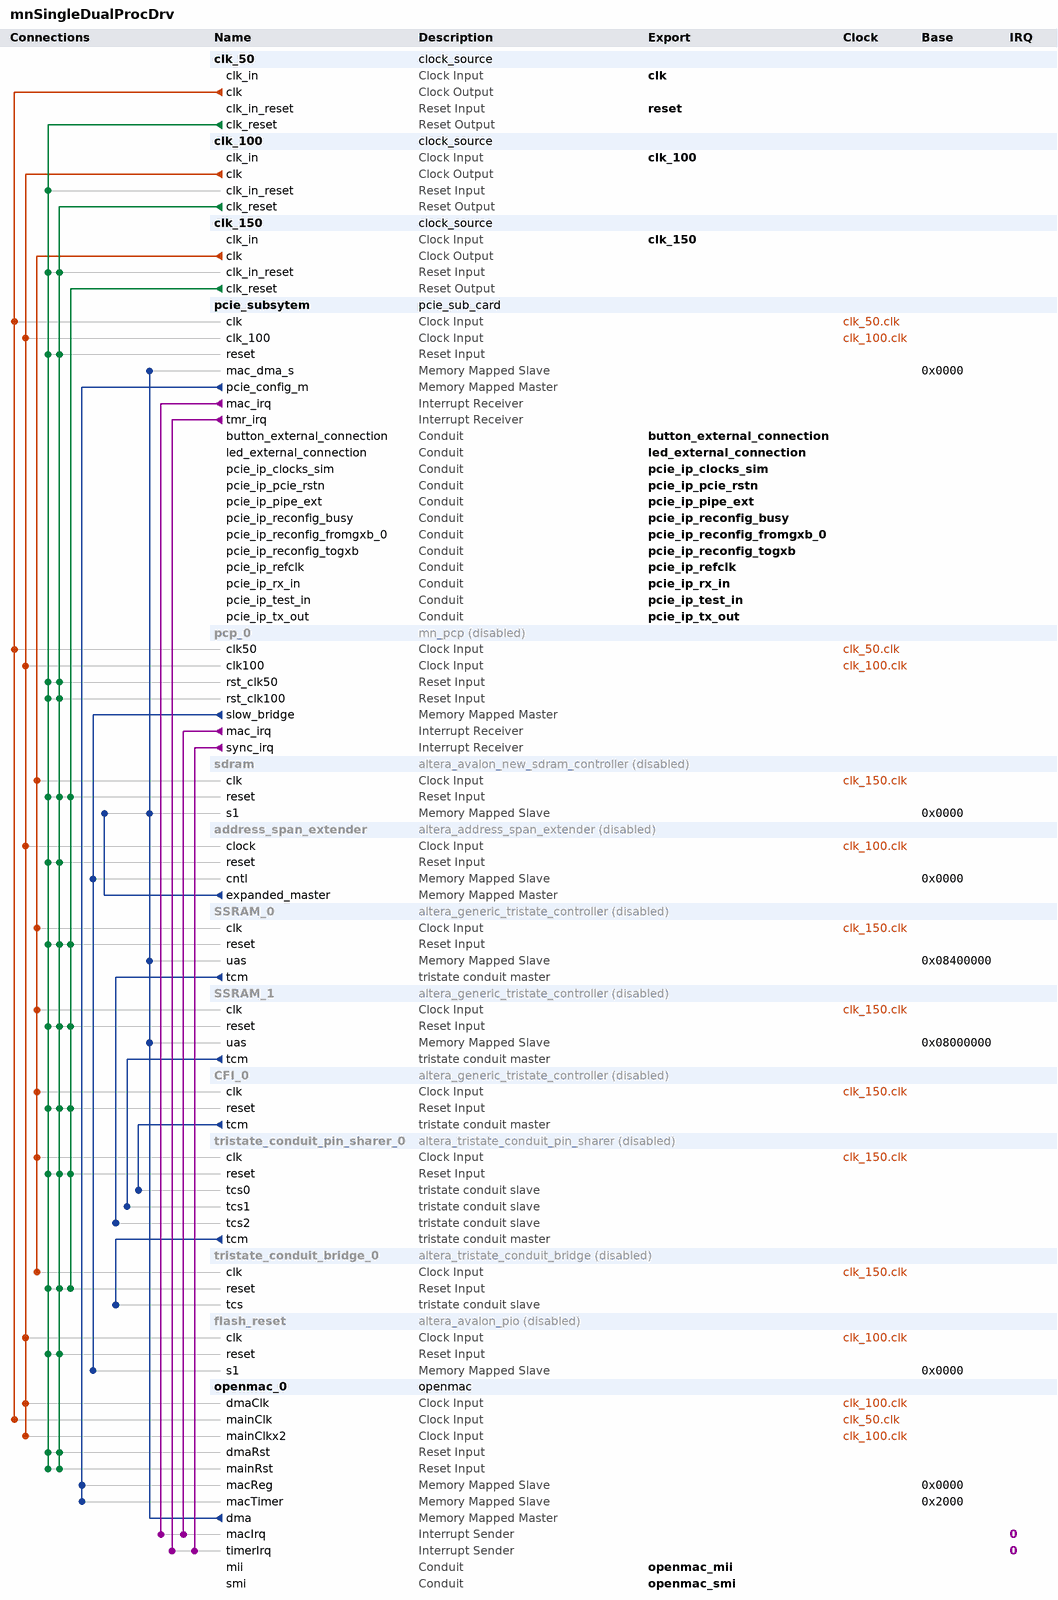
[diagram p0: system contents]
# Platform Designer (Qsys) system mnSingleDualProcDrv, Cyclone IV GX EP4CGX150DF31C7
# Parameters at their usual value, and those the tool derives, are not listed.
package require -exact qsys 14.0
create_system mnSingleDualProcDrv
set_project_property DEVICE_FAMILY {Cyclone IV GX}
set_project_property DEVICE EP4CGX150DF31C7

add_instance clk_50 clock_source 14.0
set_instance_parameter_value clk_50 clockFrequency 50000000

add_instance clk_100 clock_source 14.0
set_instance_parameter_value clk_100 clockFrequency 100000000

add_instance clk_150 clock_source 14.0
set_instance_parameter_value clk_150 clockFrequency 150000000

add_instance pcie_subsytem pcie_sub_card 1.0

add_instance pcp_0 mn_pcp 1.0
set_instance_property pcp_0 ENABLED false

add_instance sdram altera_avalon_new_sdram_controller 14.0
set_instance_property sdram ENABLED false
set_instance_parameter_value sdram TAC 5.5
set_instance_parameter_value sdram TRCD 20.0
set_instance_parameter_value sdram TRP 20.0
set_instance_parameter_value sdram casLatency 3
set_instance_parameter_value sdram columnWidth 10
set_instance_parameter_value sdram dataWidth 32
set_instance_parameter_value sdram generateSimulationModel true
set_instance_parameter_value sdram model single_Micron_MT48LC4M32B2_7_chip
set_instance_parameter_value sdram numberOfBanks 4
set_instance_parameter_value sdram numberOfChipSelects 1
set_instance_parameter_value sdram powerUpDelay 100.0
set_instance_parameter_value sdram refreshPeriod 15.625
set_instance_parameter_value sdram rowWidth 13

add_instance address_span_extender altera_address_span_extender 14.0
set_instance_property address_span_extender ENABLED false
set_instance_parameter_value address_span_extender DATA_WIDTH 32
set_instance_parameter_value address_span_extender MASTER_ADDRESS_WIDTH 27
set_instance_parameter_value address_span_extender SLAVE_ADDRESS_WIDTH 16
set_instance_parameter_value address_span_extender BURSTCOUNT_WIDTH 1
set_instance_parameter_value address_span_extender MASTER_ADDRESS_DEF 0
set_instance_parameter_value address_span_extender TERMINATE_SLAVE_PORT false
set_instance_parameter_value address_span_extender MAX_PENDING_READS 1

add_instance SSRAM_0 altera_generic_tristate_controller 14.0
set_instance_property SSRAM_0 ENABLED false
set_instance_parameter_value SSRAM_0 TCM_ADDRESS_W 22
set_instance_parameter_value SSRAM_0 TCM_DATA_W 32
set_instance_parameter_value SSRAM_0 TCM_BYTEENABLE_W 4
set_instance_parameter_value SSRAM_0 TCM_READ_WAIT 3
set_instance_parameter_value SSRAM_0 TCM_WRITE_WAIT 3
set_instance_parameter_value SSRAM_0 TCM_SETUP_WAIT 3
set_instance_parameter_value SSRAM_0 TCM_DATA_HOLD 3
set_instance_parameter_value SSRAM_0 TCM_MAX_PENDING_READ_TRANSACTIONS 5
set_instance_parameter_value SSRAM_0 TCM_TURNAROUND_TIME 2
set_instance_parameter_value SSRAM_0 TCM_TIMING_UNITS 1
set_instance_parameter_value SSRAM_0 TCM_READLATENCY 3
set_instance_parameter_value SSRAM_0 TCM_SYMBOLS_PER_WORD 4
set_instance_parameter_value SSRAM_0 USE_READ 0
set_instance_parameter_value SSRAM_0 USE_BEGINTRANSFER 1
set_instance_parameter_value SSRAM_0 USE_BYTEENABLE 1
set_instance_parameter_value SSRAM_0 USE_OUTPUTENABLE 1
set_instance_parameter_value SSRAM_0 ACTIVE_LOW_READ 0
set_instance_parameter_value SSRAM_0 ACTIVE_LOW_BYTEENABLE 1
set_instance_parameter_value SSRAM_0 ACTIVE_LOW_OUTPUTENABLE 1
set_instance_parameter_value SSRAM_0 ACTIVE_LOW_BEGINTRANSFER 1
set_instance_parameter_value SSRAM_0 CHIPSELECT_THROUGH_READLATENCY 0
set_instance_parameter_value SSRAM_0 MODULE_ASSIGNMENT_KEYS embeddedsw.configuration.hwClassnameDriverSupportList,embeddedsw.CMacro.SRAM_MEMORY_SIZE,embeddedsw.CMacro.SRAM_MEMORY_UNITS,embeddedsw.CMacro.SSRAM_DATA_WIDTH,embeddedsw.CMacro.SSRAM_READ_LATENCY,embeddedsw.memoryInfo.MEM_INIT_DATA_WIDTH,embeddedsw.memoryInfo.HAS_BYTE_LANE,embeddedsw.memoryInfo.GENERATE_DAT_SYM,embeddedsw.memoryInfo.DAT_SYM_INSTALL_DIR,
set_instance_parameter_value SSRAM_0 MODULE_ASSIGNMENT_VALUES "altera_avalon_lan91c111\\,altera_avalon_cfi_flash,2,4194304,32,2,32,1,1,SIM_DIR,"
set_instance_parameter_value SSRAM_0 INTERFACE_ASSIGNMENT_KEYS embeddedsw.configuration.isMemoryDevice
set_instance_parameter_value SSRAM_0 INTERFACE_ASSIGNMENT_VALUES 1

add_instance SSRAM_1 altera_generic_tristate_controller 14.0
set_instance_property SSRAM_1 ENABLED false
set_instance_parameter_value SSRAM_1 TCM_ADDRESS_W 22
set_instance_parameter_value SSRAM_1 TCM_DATA_W 32
set_instance_parameter_value SSRAM_1 TCM_BYTEENABLE_W 4
set_instance_parameter_value SSRAM_1 TCM_READ_WAIT 3
set_instance_parameter_value SSRAM_1 TCM_WRITE_WAIT 3
set_instance_parameter_value SSRAM_1 TCM_SETUP_WAIT 3
set_instance_parameter_value SSRAM_1 TCM_DATA_HOLD 3
set_instance_parameter_value SSRAM_1 TCM_MAX_PENDING_READ_TRANSACTIONS 5
set_instance_parameter_value SSRAM_1 TCM_TURNAROUND_TIME 2
set_instance_parameter_value SSRAM_1 TCM_TIMING_UNITS 1
set_instance_parameter_value SSRAM_1 TCM_READLATENCY 3
set_instance_parameter_value SSRAM_1 TCM_SYMBOLS_PER_WORD 4
set_instance_parameter_value SSRAM_1 USE_READ 0
set_instance_parameter_value SSRAM_1 USE_BEGINTRANSFER 1
set_instance_parameter_value SSRAM_1 USE_BYTEENABLE 1
set_instance_parameter_value SSRAM_1 USE_OUTPUTENABLE 1
set_instance_parameter_value SSRAM_1 ACTIVE_LOW_READ 0
set_instance_parameter_value SSRAM_1 ACTIVE_LOW_BYTEENABLE 1
set_instance_parameter_value SSRAM_1 ACTIVE_LOW_OUTPUTENABLE 1
set_instance_parameter_value SSRAM_1 ACTIVE_LOW_BEGINTRANSFER 1
set_instance_parameter_value SSRAM_1 CHIPSELECT_THROUGH_READLATENCY 0
set_instance_parameter_value SSRAM_1 MODULE_ASSIGNMENT_KEYS embeddedsw.configuration.hwClassnameDriverSupportList,embeddedsw.CMacro.SRAM_MEMORY_SIZE,embeddedsw.CMacro.SRAM_MEMORY_UNITS,embeddedsw.CMacro.SSRAM_DATA_WIDTH,embeddedsw.CMacro.SSRAM_READ_LATENCY,embeddedsw.memoryInfo.MEM_INIT_DATA_WIDTH,embeddedsw.memoryInfo.HAS_BYTE_LANE,embeddedsw.memoryInfo.GENERATE_DAT_SYM,embeddedsw.memoryInfo.DAT_SYM_INSTALL_DIR,
set_instance_parameter_value SSRAM_1 MODULE_ASSIGNMENT_VALUES "altera_avalon_lan91c111\\,altera_avalon_cfi_flash,2,4194304,32,2,32,1,1,SIM_DIR,"
set_instance_parameter_value SSRAM_1 INTERFACE_ASSIGNMENT_KEYS embeddedsw.configuration.isMemoryDevice
set_instance_parameter_value SSRAM_1 INTERFACE_ASSIGNMENT_VALUES 1

add_instance CFI_0 altera_generic_tristate_controller 14.0
set_instance_property CFI_0 ENABLED false
set_instance_parameter_value CFI_0 TCM_ADDRESS_W 26
set_instance_parameter_value CFI_0 TCM_DATA_W 16
set_instance_parameter_value CFI_0 TCM_BYTEENABLE_W 2
set_instance_parameter_value CFI_0 TCM_READ_WAIT 160
set_instance_parameter_value CFI_0 TCM_WRITE_WAIT 160
set_instance_parameter_value CFI_0 TCM_SETUP_WAIT 60
set_instance_parameter_value CFI_0 TCM_DATA_HOLD 60
set_instance_parameter_value CFI_0 TCM_MAX_PENDING_READ_TRANSACTIONS 3
set_instance_parameter_value CFI_0 TCM_TURNAROUND_TIME 2
set_instance_parameter_value CFI_0 TCM_TIMING_UNITS 0
set_instance_parameter_value CFI_0 TCM_READLATENCY 2
set_instance_parameter_value CFI_0 TCM_SYMBOLS_PER_WORD 2
set_instance_parameter_value CFI_0 USE_READ 0
set_instance_parameter_value CFI_0 USE_BEGINTRANSFER 0
set_instance_parameter_value CFI_0 USE_BYTEENABLE 0
set_instance_parameter_value CFI_0 USE_OUTPUTENABLE 1
set_instance_parameter_value CFI_0 USE_RESET_OUTPUT 1
set_instance_parameter_value CFI_0 ACTIVE_LOW_READ 0
set_instance_parameter_value CFI_0 ACTIVE_LOW_BYTEENABLE 0
set_instance_parameter_value CFI_0 ACTIVE_LOW_OUTPUTENABLE 1
set_instance_parameter_value CFI_0 ACTIVE_LOW_BEGINTRANSFER 0
set_instance_parameter_value CFI_0 ACTIVE_LOW_RESET_OUTPUT 1
set_instance_parameter_value CFI_0 CHIPSELECT_THROUGH_READLATENCY 0
set_instance_parameter_value CFI_0 MODULE_ASSIGNMENT_KEYS embeddedsw.configuration.hwClassnameDriverSupportList,embeddedsw.configuration.hwClassnameDriverSupportDefault,embeddedsw.CMacro.SETUP_VALUE,embeddedsw.CMacro.WAIT_VALUE,embeddedsw.CMacro.HOLD_VALUE,embeddedsw.CMacro.TIMING_UNITS,embeddedsw.CMacro.SIZE,embeddedsw.memoryInfo.MEM_INIT_DATA_WIDTH,embeddedsw.memoryInfo.HAS_BYTE_LANE,embeddedsw.memoryInfo.IS_FLASH,embeddedsw.memoryInfo.GENERATE_DAT_SYM,embeddedsw.memoryInfo.GENERATE_FLASH,embeddedsw.memoryInfo.DAT_SYM_INSTALL_DIR,embeddedsw.memoryInfo.FLASH_INSTALL_DIR,
set_instance_parameter_value CFI_0 MODULE_ASSIGNMENT_VALUES {altera_avalon_lan91c111:altera_avalon_cfi_flash,altera_avalon_cfi_flash,60,160,60,"ns",67108864u,8,1,1,1,1,SIM_DIR,APP_DIR,}
set_instance_parameter_value CFI_0 INTERFACE_ASSIGNMENT_KEYS embeddedsw.configuration.isFlash,embeddedsw.configuration.isMemoryDevice,embeddedsw.configuration.isNonVolatileStorage
set_instance_parameter_value CFI_0 INTERFACE_ASSIGNMENT_VALUES 1,1,1

add_instance tristate_conduit_pin_sharer_0 altera_tristate_conduit_pin_sharer 14.0
set_instance_property tristate_conduit_pin_sharer_0 ENABLED false
set_instance_parameter_value tristate_conduit_pin_sharer_0 NUM_INTERFACES 3
set_instance_parameter_value tristate_conduit_pin_sharer_0 MODULE_ORIGIN_LIST SSRAM_0.tcm,SSRAM_0.tcm,SSRAM_0.tcm,SSRAM_0.tcm,SSRAM_0.tcm,SSRAM_0.tcm,SSRAM_0.tcm,SSRAM_1.tcm,SSRAM_1.tcm,SSRAM_1.tcm,SSRAM_1.tcm,SSRAM_1.tcm,SSRAM_1.tcm,SSRAM_1.tcm,CFI_0.tcm,CFI_0.tcm,CFI_0.tcm,CFI_0.tcm,CFI_0.tcm,CFI_0.tcm
set_instance_parameter_value tristate_conduit_pin_sharer_0 SIGNAL_ORIGIN_LIST address,outputenable_n,byteenable_n,begintransfer_n,write_n,data,chipselect_n,address,outputenable_n,byteenable_n,begintransfer_n,write_n,data,chipselect_n,address,outputenable_n,reset_n,write_n,data,chipselect_n
set_instance_parameter_value tristate_conduit_pin_sharer_0 SHARED_SIGNAL_LIST ADDR,SSRAM_OE_N,SSRAM_BE_N,SSRAM_BT_N,SSRAM_WR_N,DATA,SSRAM_0_CS_N,ADDR,SSRAM_OE_N,SSRAM_BE_N,SSRAM_BT_N,SSRAM_WR_N,DATA,SSRAM_1_CS_N,ADDR,CFI_0_OE_N,CFI_0_RST_N,CFI_0_WR_N,DATA,CFI_0_CS_N

add_instance tristate_conduit_bridge_0 altera_tristate_conduit_bridge 14.0
set_instance_property tristate_conduit_bridge_0 ENABLED false

add_instance flash_reset altera_avalon_pio 14.0
set_instance_property flash_reset ENABLED false
set_instance_parameter_value flash_reset direction Output
set_instance_parameter_value flash_reset resetValue 1
set_instance_parameter_value flash_reset width 1

add_instance openmac_0 openmac 1.0.0
set_instance_parameter_value openmac_0 gui_phyType 2
set_instance_parameter_value openmac_0 gui_phyCount 1
set_instance_parameter_value openmac_0 gui_extraSmi false
set_instance_parameter_value openmac_0 gui_txBufLoc 2
set_instance_parameter_value openmac_0 gui_txBufSize 16
set_instance_parameter_value openmac_0 gui_txBurstSize 8
set_instance_parameter_value openmac_0 gui_rxBurstSize 8
set_instance_parameter_value openmac_0 gui_tmrCount 1
set_instance_parameter_value openmac_0 gui_actEn false
set_instance_parameter_value openmac_0 gui_sdcEn true

# connections
add_connection clk_50.clk openmac_0.mainClk clock
add_connection clk_50.clk pcie_subsytem.clk clock
add_connection clk_50.clk pcp_0.clk50 clock
add_connection clk_100.clk address_span_extender.clock clock
add_connection clk_100.clk flash_reset.clk clock
add_connection clk_100.clk openmac_0.dmaClk clock
add_connection clk_100.clk openmac_0.mainClkx2 clock
add_connection clk_100.clk pcie_subsytem.clk_100 clock
add_connection clk_100.clk pcp_0.clk100 clock
add_connection clk_150.clk CFI_0.clk clock
add_connection clk_150.clk sdram.clk clock
add_connection clk_150.clk SSRAM_0.clk clock
add_connection clk_150.clk SSRAM_1.clk clock
add_connection clk_150.clk tristate_conduit_bridge_0.clk clock
add_connection clk_150.clk tristate_conduit_pin_sharer_0.clk clock
add_connection clk_50.clk_reset address_span_extender.reset reset
add_connection clk_50.clk_reset CFI_0.reset reset
add_connection clk_50.clk_reset clk_100.clk_in_reset reset
add_connection clk_50.clk_reset clk_150.clk_in_reset reset
add_connection clk_50.clk_reset flash_reset.reset reset
add_connection clk_50.clk_reset openmac_0.dmaRst reset
add_connection clk_50.clk_reset openmac_0.mainRst reset
add_connection clk_50.clk_reset pcie_subsytem.reset reset
add_connection clk_50.clk_reset pcp_0.rst_clk50 reset
add_connection clk_50.clk_reset pcp_0.rst_clk100 reset
add_connection clk_50.clk_reset sdram.reset reset
add_connection clk_50.clk_reset SSRAM_0.reset reset
add_connection clk_50.clk_reset SSRAM_1.reset reset
add_connection clk_50.clk_reset tristate_conduit_bridge_0.reset reset
add_connection clk_50.clk_reset tristate_conduit_pin_sharer_0.reset reset
add_connection clk_100.clk_reset address_span_extender.reset reset
add_connection clk_100.clk_reset CFI_0.reset reset
add_connection clk_100.clk_reset clk_150.clk_in_reset reset
add_connection clk_100.clk_reset flash_reset.reset reset
add_connection clk_100.clk_reset openmac_0.dmaRst reset
add_connection clk_100.clk_reset openmac_0.mainRst reset
add_connection clk_100.clk_reset pcie_subsytem.reset reset
add_connection clk_100.clk_reset pcp_0.rst_clk50 reset
add_connection clk_100.clk_reset pcp_0.rst_clk100 reset
add_connection clk_100.clk_reset sdram.reset reset
add_connection clk_100.clk_reset SSRAM_0.reset reset
add_connection clk_100.clk_reset SSRAM_1.reset reset
add_connection clk_100.clk_reset tristate_conduit_bridge_0.reset reset
add_connection clk_100.clk_reset tristate_conduit_pin_sharer_0.reset reset
add_connection clk_150.clk_reset CFI_0.reset reset
add_connection clk_150.clk_reset sdram.reset reset
add_connection clk_150.clk_reset SSRAM_0.reset reset
add_connection clk_150.clk_reset SSRAM_1.reset reset
add_connection clk_150.clk_reset tristate_conduit_bridge_0.reset reset
add_connection clk_150.clk_reset tristate_conduit_pin_sharer_0.reset reset
add_connection address_span_extender.expanded_master sdram.s1 avalon
set_connection_parameter_value address_span_extender.expanded_master/sdram.s1 baseAddress 0x0000
add_connection openmac_0.dma pcie_subsytem.mac_dma_s avalon
set_connection_parameter_value openmac_0.dma/pcie_subsytem.mac_dma_s baseAddress 0x0000
add_connection openmac_0.dma sdram.s1 avalon
set_connection_parameter_value openmac_0.dma/sdram.s1 baseAddress 0x0000
add_connection openmac_0.dma SSRAM_0.uas avalon
set_connection_parameter_value openmac_0.dma/SSRAM_0.uas baseAddress 0x08400000
add_connection openmac_0.dma SSRAM_1.uas avalon
set_connection_parameter_value openmac_0.dma/SSRAM_1.uas baseAddress 0x08000000
add_connection pcie_subsytem.pcie_config_m openmac_0.macReg avalon
set_connection_parameter_value pcie_subsytem.pcie_config_m/openmac_0.macReg baseAddress 0x0000
add_connection pcie_subsytem.pcie_config_m openmac_0.macTimer avalon
set_connection_parameter_value pcie_subsytem.pcie_config_m/openmac_0.macTimer baseAddress 0x2000
add_connection pcp_0.slow_bridge address_span_extender.cntl avalon
set_connection_parameter_value pcp_0.slow_bridge/address_span_extender.cntl baseAddress 0x0000
add_connection pcp_0.slow_bridge flash_reset.s1 avalon
set_connection_parameter_value pcp_0.slow_bridge/flash_reset.s1 baseAddress 0x0000
add_connection pcie_subsytem.mac_irq openmac_0.macIrq interrupt
set_connection_parameter_value pcie_subsytem.mac_irq/openmac_0.macIrq irqNumber 0
add_connection pcie_subsytem.tmr_irq openmac_0.timerIrq interrupt
set_connection_parameter_value pcie_subsytem.tmr_irq/openmac_0.timerIrq irqNumber 0
add_connection pcp_0.mac_irq openmac_0.macIrq interrupt
set_connection_parameter_value pcp_0.mac_irq/openmac_0.macIrq irqNumber 0
add_connection pcp_0.sync_irq openmac_0.timerIrq interrupt
set_connection_parameter_value pcp_0.sync_irq/openmac_0.timerIrq irqNumber 0
add_connection CFI_0.tcm tristate_conduit_pin_sharer_0.tcs0 tristate_conduit
add_connection SSRAM_0.tcm tristate_conduit_pin_sharer_0.tcs2 tristate_conduit
add_connection SSRAM_1.tcm tristate_conduit_pin_sharer_0.tcs1 tristate_conduit
add_connection tristate_conduit_pin_sharer_0.tcm tristate_conduit_bridge_0.tcs tristate_conduit

# exported interfaces
add_interface clk clock sink
set_interface_property clk EXPORT_OF clk_50.clk_in
add_interface reset reset sink
set_interface_property reset EXPORT_OF clk_50.clk_in_reset
add_interface clk_100 clock sink
set_interface_property clk_100 EXPORT_OF clk_100.clk_in
add_interface led_external_connection conduit end
set_interface_property led_external_connection EXPORT_OF pcie_subsytem.led_external_connection
add_interface button_external_connection conduit end
set_interface_property button_external_connection EXPORT_OF pcie_subsytem.button_external_connection
add_interface pcie_ip_reconfig_togxb conduit end
set_interface_property pcie_ip_reconfig_togxb EXPORT_OF pcie_subsytem.pcie_ip_reconfig_togxb
add_interface pcie_ip_refclk conduit end
set_interface_property pcie_ip_refclk EXPORT_OF pcie_subsytem.pcie_ip_refclk
add_interface pcie_ip_test_in conduit end
set_interface_property pcie_ip_test_in EXPORT_OF pcie_subsytem.pcie_ip_test_in
add_interface pcie_ip_pcie_rstn conduit end
set_interface_property pcie_ip_pcie_rstn EXPORT_OF pcie_subsytem.pcie_ip_pcie_rstn
add_interface pcie_ip_clocks_sim conduit end
set_interface_property pcie_ip_clocks_sim EXPORT_OF pcie_subsytem.pcie_ip_clocks_sim
add_interface pcie_ip_reconfig_busy conduit end
set_interface_property pcie_ip_reconfig_busy EXPORT_OF pcie_subsytem.pcie_ip_reconfig_busy
add_interface pcie_ip_pipe_ext conduit end
set_interface_property pcie_ip_pipe_ext EXPORT_OF pcie_subsytem.pcie_ip_pipe_ext
add_interface pcie_ip_rx_in conduit end
set_interface_property pcie_ip_rx_in EXPORT_OF pcie_subsytem.pcie_ip_rx_in
add_interface pcie_ip_tx_out conduit end
set_interface_property pcie_ip_tx_out EXPORT_OF pcie_subsytem.pcie_ip_tx_out
add_interface pcie_ip_reconfig_fromgxb_0 conduit end
set_interface_property pcie_ip_reconfig_fromgxb_0 EXPORT_OF pcie_subsytem.pcie_ip_reconfig_fromgxb_0
add_interface openmac_mii conduit end
set_interface_property openmac_mii EXPORT_OF openmac_0.mii
add_interface openmac_smi conduit end
set_interface_property openmac_smi EXPORT_OF openmac_0.smi
add_interface clk_150 clock sink
set_interface_property clk_150 EXPORT_OF clk_150.clk_in

set_interconnect_requirement {$system} qsys_mm.clockCrossingAdapter HANDSHAKE
set_interconnect_requirement {$system} qsys_mm.maxAdditionalLatency 1

save_system mnSingleDualProcDrv.qsys
